# Altium schematic sheet IOa.SchDoc
size A4; SheetNumber: 8; SheetTotal: 9
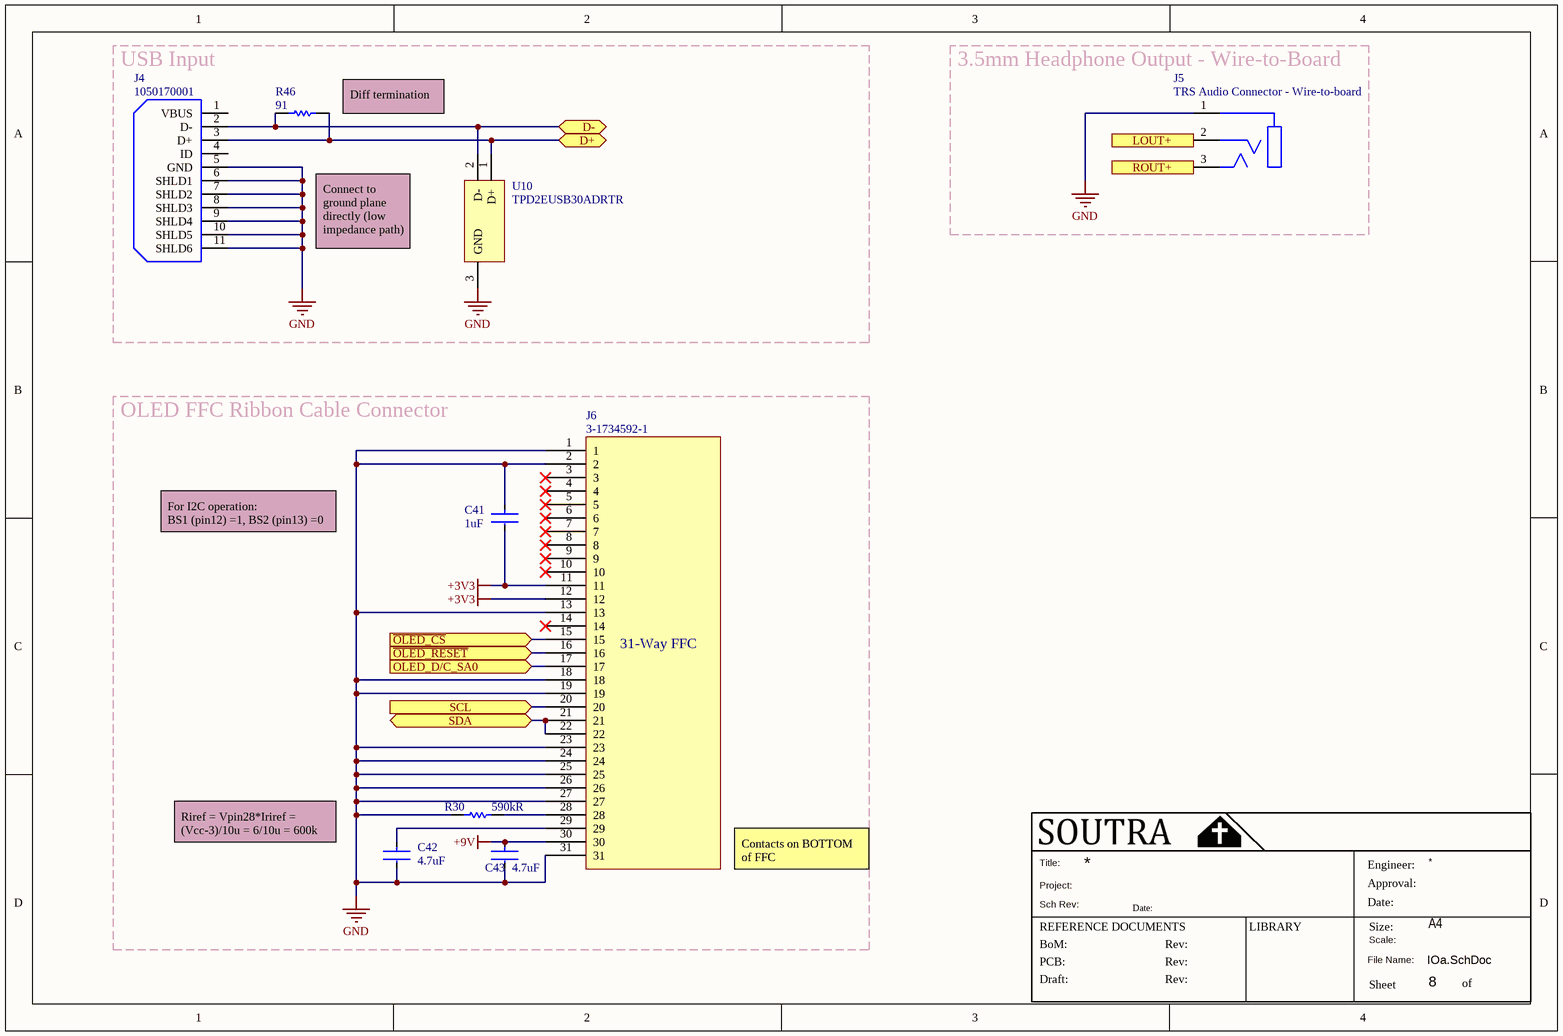
[diagram p0: IOa.SchDoc]

## Parts
C41  value 1uF  [CAPC1005X06L]  (hidden comment: CC0402KRX5R6BB105)
C42  value 4.7uF  [CC1206-IPC_A]  (hidden comment: CL31B475KAHNNNE)
C43  value 4.7uF  [CC1206-IPC_A]  (hidden comment: CL31B475KAHNNNE)
J4  1050170001  [1050170001_USB-MICRO-B_V]
J5  TRS Audio Connector - Wire-to-board  [J_GENERIC_PIN-HEADER_2.54_1X3]
J6  3-1734592-1  [AMP-TE_3-1734592-1]
R30  value 590kR  [RESC_0402_1005X40X25LL05T10]  (hidden comment: RC0402FR-07590KL)
R46  value 91  [RESC_0603_1608X06L]  (hidden comment: ERJ-PA3F91R0V)
U10  TPD2EUSB30ADRTR  [DRT0003A]

## Blocks framed on the sheet
USB Input: J4 R46 U10
3.5mm Headphone Output - Wire-to-Board: J5

## Ports
D+ (bidir, see Block Diagram[3C], MCU[1C]), D- (bidir, see Block Diagram[3C], MCU[1C]), LOUT+ (in, see Block Diagram[4C], Amplifiers[1B], CODEC[3B]), OLED_D/C_SA0 (in, see Block Diagram[3C], MCU[3C]), ROUT+ (in, see Block Diagram[4C], Amplifiers[3B], CODEC[3B]), SCL (in, see Block Diagram[3C], Amplifiers[1A], CODEC[2B], MCU[4B]), SDA (bidir, see Block Diagram[3C], Amplifiers[1A], CODEC[2B], MCU[4B]), ~{OLED_CS} (in, see Block Diagram[3C], MCU[3C]), ~{OLED_RESET} (in, see Block Diagram[3C], MCU[3C])

## Nets
+3V3: C41.2 J6.11 J6.12
+9V: C43.1 J6.30
GND: C41.1 C42.2 C43.2 J4.5(GND) J4.6(SHLD1) J4.7(SHLD2) J4.8(SHLD3) J4.9(SHLD4) J4.10(SHLD5) J4.11(SHLD6) J5.1 J6.1 J6.2 J6.13 J6.18 J6.19 J6.23 J6.24 J6.25 J6.26 J6.27 J6.31 R30.1 U10.3(GND)
~{OLED_CS}: J6.15 ; port ~{OLED_CS}
~{OLED_RESET}: J6.16 ; port ~{OLED_RESET}
D+: J4.3(D+) R46.2 U10.1(D+) ; port D+
D-: J4.2(D-) R46.1 U10.2(D-) ; port D-
LOUT+: J5.2 ; port LOUT+
OLED_D/C_SA0: J6.17 ; port OLED_D/C_SA0
ROUT+: J5.3 ; port ROUT+
SCL: J6.20 ; port SCL
SDA: J6.21 J6.22 ; port SDA
NetC42_1: C42.1 J6.29
NetJ6_28: J6.28 R30.2

Not connected (* = marked no-connect by the designer): J4 1(VBUS) 4(ID); J6 3* 4* 5* 6* 7* 8* 9* 10* 14*

## Notes on the sheet
- (near R46) Diff termination
- Connect to ground plane directly (low impedance path)
- OLED FFC Ribbon Cable Connector
- For I2C operation:
  BS1 (pin12) =1, BS2 (pin13) =0
- Riref = Vpin28*Iriref = (Vcc-3)/10u = 6/10u = 600k
- Contacts on BOTTOM of FFC
- Title:
- Project:
- Sch Rev:
- Date:
- Engineer:
- Approval:
- REFERENCE DOCUMENTS
- BoM:
- PCB:
- Draft:
- Rev:
- LIBRARY
- File Name:
- Scale:
- Size:
- Sheet
- A4
- of
- (in symbol 3-1734592-1) 31-Way FFC

## Library data of the parts
C41 = CC0402KRX5R6BB105: Ceramic Capacitor, Multilayer, Ceramic, 10V, 10% +Tol, 10% -Tol, X5R, 15% TC, 1uF, Surface Mount, 0402; Manufacturer: Yageo; Alternative Part: 0402ZD105KAT2A; Alternative Part Manufacturer: KYOCERA AVX; Multilayer: Yes; Supplier: Farnell; Supplier Part Number: 1458896; Manufacturer Part Number: CC0402KRX5R6BB105; RoHS: Yes; Category: Ceramic Capacitors; Stock: 12220000; Pricing: 10=0.039, 100=0.023; Mounting Technology: Surface Mount; Pins: 2; Dielectric Material: Ceramic; Package Shape: Rectangular; Case/Package: 0402; Terminal Finish: Nickel; Min Operating Temperature: -55°C; Max Operating Temperature: 85°C; JESD-609 Code: e3; Capacitor Type: Ceramic; Tolerance  (fill in as +-): 10%; Package Style: SMTMeter; Packaging: Tape and Reel; Tolerance (fill in as +-): 10%; Rated DC Voltage (URdc): 10V; Temperature Characteristics Code: X5R; Termination: Wraparound; Length: 1mm; Width: 0.5mm; Height: 0.5mm; Reach SVHC Compliant: Yes; RoHS Compliant: Yes; ComponentLink1URL: https://datasheet.ciiva.com:443/pdfs/VipMasterIC/IC/YAGO/YAGO-S-A0006851646/YAGO-S-A0006851646-1.pdf?src-supplier=IHS+Markit; ComponentLink1Description: https://datasheet.ciiva.com:443/pdfs/VipMasterIC/IC/YAGO/YAGO-S-A0006851646/YAGO-S-A0006851646-1.pdf?src-supplier=IHS+Markit; ComponentLink2URL: https://datasheet.ciiva.com/176/upy-gphc-x5r-4v-to-50v-12-176704.pdf?src-supplier=Digi-Key; ComponentLink2Description: https://datasheet.ciiva.com/176/upy-gphc-x5r-4v-to-50v-12-176704.pdf?src-supplier=Digi-Key; ComponentLink3URL: https://datasheet.ciiva.com/176/mlccorderingcode-176705.pdf?src-supplier=Digi-Key; ComponentLink3Description: https://datasheet.ciiva.com/176/mlccorderingcode-176705.pdf?src-supplier=Digi-Key; ComponentLink4URL: https://datasheet.ciiva.com/176/mlccorderingcode-176706.pdf?src-supplier=Digi-Key; ComponentLink4Description: https://datasheet.ciiva.com/176/mlccorderingcode-176706.pdf?src-supplier=Digi-Key; Supplier 1: Digikey; Supplier Part Number 1: 311-1439-1-ND; Pricing 1: 1=0.08, 10=0.058, 50=0.034, 100=0.027; Alternative Part Supplier: Farnell; Alternative Part Supplier Part Number: 1740588
C42 C43 = CL31B475KAHNNNE: Ceramic Capacitor, Multilayer, Ceramic, 25V, 10% +Tol, 10% -Tol, X7R, 15% TC, 4.7uF, Surface Mount, 1206; Manufacturer: Samsung; Multilayer: Yes; Supplier: Digikey; Supplier Part Number: 1276-1055-1-ND; Manufacturer Part Number: CL31B475KAHNNNE; RoHS: Yes; Category: Ceramic Capacitors; Stock: 245034; Pricing: 1=0.18, 10=0.116, 50=0.0732, 100=0.0585, 500=0.04228, 1000=0.0374 (USD); Mounting Technology: Surface Mount; Pins: 2; Dielectric Material: Ceramic; Package Shape: Rectangular; Case/Package: 1206; Terminal Finish: Nickel; Min Operating Temperature: -55°C; Max Operating Temperature: 125°C; JESD-609 Code: e3; Capacitor Type: Ceramic; Tolerance  (fill in as +-): 10%; Package Style: SMTMeter; Packaging: Tape and Reel; Tolerance (fill in as +-): 10%; Rated DC Voltage (URdc): 25V; Temperature Characteristics Code: X7R; Termination: Wraparound; Length: 3.2mm; Width: 1.6mm; Height: 1.8mm; Reach SVHC Compliant: Yes; RoHS Compliant: Yes; ComponentLink1URL: https://datasheet.ciiva.com:443/pdfs/VipMasterIC/IC/SEMS/SEMS-S-A0008522756/SEMS-S-A0008522493-1.pdf?src-supplier=IHS+Markit; ComponentLink1Description: https://datasheet.ciiva.com:443/pdfs/VipMasterIC/IC/SEMS/SEMS-S-A0008522756/SEMS-S-A0008522493-1.pdf?src-supplier=IHS+Markit; ComponentLink2URL: https://datasheet.ciiva.com/25728/cl31b475kahnnne-25728538.pdf?src-supplier=Digikey; ComponentLink2Description: https://datasheet.ciiva.com/25728/cl31b475kahnnne-25728538.pdf?src-supplier=Digikey; ComponentLink3URL: https://datasheet.ciiva.com/29200/452772-da-01-en-vs-kondensator-1206-29200897.pdf?src-supplier=Conrad; ComponentLink3Description: https://datasheet.ciiva.com/29200/452772-da-01-en-vs-kondensator-1206-29200897.pdf?src-supplier=Conrad; ComponentLink4URL: https://datasheet.ciiva.com/29200/452785-da-01-en-vs-kondensator-1206-29200901.pdf?src-supplier=Conrad; ComponentLink4Description: https://datasheet.ciiva.com/29200/452785-da-01-en-vs-kondensator-1206-29200901.pdf?src-supplier=Conrad; ComponentLink5URL: https://datasheet.ciiva.com/26310/mlcc-catalogdownload2013-eng-26310092.pdf?src-supplier=Distrelec; ComponentLink5Description: https://datasheet.ciiva.com/26310/mlcc-catalogdownload2013-eng-26310092.pdf?src-supplier=Distrelec; ComponentLink6URL: https://datasheet.ciiva.com/16428/cl10c1r5bb8nnnc-16428942.pdf?src-supplier=Future+Electronics; ComponentLink6Description: https://datasheet.ciiva.com/16428/cl10c1r5bb8nnnc-16428942.pdf?src-supplier=Future+Electronics; Supplier 1: Farnell; Supplier Part Number 1: 3013532; Pricing 1: 5=0.08, 50=0.05
J4 = 1050170001: Telecom and Datacom Connector, 5 Contact(s), Female, Right Angle, Surface Mount Terminal, Detent, Receptacle; Manufacturer Part Number: 105017-0001; Manufacturer: Molex; Supplier 1: Rs; Supplier Part Number 1: 8486764; Supplier: Farnell; Supplier Part Number: 3500663; Pricing: 1=0.97; Pricing 1: 5=0.754, 75=0.67
J5 = J_AUDIO_TRS
J6 = 3-1734592-1: FFC/FPC Connector, 31 Contact(s), 1 Row(s), Female, Right Angle, 0.02 inch Pitch, Surface Mount Terminal, Locking, Natural Insulator; Manufacturer: TE Connectivity; Connector Type: CARD EDGE CONNECTOR; Option: General Purpose; Number of Rows Loaded: 1; Number of Contacts: 31; Contact Pattern: RECTANGULAR; Contact Resistance: 35mR; Contact Style: BELLOWED TYPE; Insulation Resistance: 50MR; Rated Current (Signal): 500mA; Filter Feature: No; Dielectric Withstanding Voltage (AC): 250V; Durability: 15Cycles; Body Breadth: 0.079inch; Body Depth: 0.201inch; Body Length: 0.824inch; Reference Standard: UL; Reliability: COMMERCIAL; Supplier 1: Farnell; Supplier Part Number 1: 3398664; Manufacturer Part Number: 3-1734592-1; RoHS: Yes; Category: FFC / FPC; Stock 1: 10236; Pricing 1: 1=1.44, 10=1.26, 100=1.15; Mounting Technology: Board; Contact Finish - Mating: NOT SPECIFIED; Insulation Color: Natural; Insulation Material: Thermoplastic; Min Operating Temperature: -40°C; Max Operating Temperature: 85°C; Contact Gender: Female; Mounting Style: RIGHT ANGLE; Termination: SMD/SMT; Number Of PCB Rows: 1; PCB Contact Pattern: RECTANGULAR; Mixed Contacts: No; Manufacturer Series: 1734592; Mating Information: NO; Terminal Pitch: 0.5mm; Mating Contact Pitch: 0.02inch; Mounting Option 1: LOCKING; Flammability Rating: UL94 V-0; DIN Conformance: No; IEC Conformance: No; MIL Conformance: No; Reach SVHC Compliant: Yes; RoHS Compliant: Yes; ComponentLink1URL: https://www.te.com:443/usa-en/product-3-1734592-1.datasheet.pdf?src-supplier=IHS+Markit; ComponentLink1Description: https://www.te.com:443/usa-en/product-3-1734592-1.datasheet.pdf?src-supplier=IHS+Markit; ComponentLink2URL: https://datasheet.ciiva.com/10364/eng-ds-1-1773440-6-0506-10364463.pdf?src-supplier=Avnet; ComponentLink2Description: https://datasheet.ciiva.com/10364/eng-ds-1-1773440-6-0506-10364463.pdf?src-supplier=Avnet; ComponentLink3URL: https://datasheet.ciiva.com/8066/1650059-8066840.pdf?src-supplier=Element14; ComponentLink3Description: https://datasheet.ciiva.com/8066/1650059-8066840.pdf?src-supplier=Element14; ComponentLink4URL: https://datasheet.ciiva.com/49629/eng-ds-1-1773440-6-0506-49629301.pdf?src-supplier=Onlinecomponents.com; ComponentLink4Description: https://datasheet.ciiva.com/49629/eng-ds-1-1773440-6-0506-49629301.pdf?src-supplier=Onlinecomponents.com; ComponentLink5URL: https://datasheet.ciiva.com/671/eng-cd-1734592-c-c-1734592-671970.pdf?src-supplier=Digikey; ComponentLink5Description: https://datasheet.ciiva.com/671/eng-cd-1734592-c-c-1734592-671970.pdf?src-supplier=Digikey; ComponentLink6URL: https://datasheet.ciiva.com/671/eng-cd-1734592-c-c-1734592-671971.pdf?src-supplier=Digikey; ComponentLink6Description: https://datasheet.ciiva.com/671/eng-cd-1734592-c-c-1734592-671971.pdf?src-supplier=Digikey; ComponentLink7URL: https://datasheet.ciiva.com/671/eng-cd-1734592-c-c-1734592-671972.pdf?src-supplier=Digikey; ComponentLink7Description: https://datasheet.ciiva.com/671/eng-cd-1734592-c-c-1734592-671972.pdf?src-supplier=Digikey
R30 = RC0402FR-07590KL: Fixed Resistor, Metal Glaze/thick Film, 0.0625W, 590000ohm, 50V, 1% +/-Tol, 100ppm/Cel, Surface Mount, 0402; Manufacturer: Yageo; Alternative Part: CRCW0402590KFKED; Alternative Part Manufacturer: Vishay; Additional Feature: LASER TRIMMABLE; Power: 62.5mW; Rated Temperature: 70°C; Temperature Coefficient: 100ppm/°C; Package Height: 0.35mm; Package Length: 1mm; Package Width: 0.5mm; Supplier 1: Farnell; Supplier Part Number 1: 3951243; Manufacturer Part Number: RC0402FR-07590KL; RoHS: Yes; Category: Chip SMD Resistors; Stock 1: 37168; Pricing 1: 10=0.0096, 100=0.0055; Mounting Technology: Surface Mount; Pins: 2; Package Shape: Rectangular; Case/Package: 0402; Terminal Finish: Nickel; Min Operating Temperature: -55°C; Max Operating Temperature: 155°C; Tolerance: 1%; JESD-609 Code: e3; Resistor Type: FIXED RESISTOR; Construction: Chip; Package Style: SMTMeter; Packaging: Tape and Reel; Technology: METAL GLAZE/THICK FILM; Termination: Wraparound; Working Voltage: 50V; Reach SVHC Compliant: Yes; RoHS Compliant: Yes; ComponentLink1URL: https://datasheet.ciiva.com:443/pdfs/VipMasterIC/IC/YAGO/YAGO-S-A0008145938/YAGO-S-A0008145938-1.pdf?src-supplier=IHS+Markit; ComponentLink1Description: https://datasheet.ciiva.com:443/pdfs/VipMasterIC/IC/YAGO/YAGO-S-A0008145938/YAGO-S-A0008145938-1.pdf?src-supplier=IHS+Markit; ComponentLink2URL: https://datasheet.ciiva.com/8885/pyu-rc0402-51-rohs-l-6-8885212.pdf?src-supplier=Avnet; ComponentLink2Description: https://datasheet.ciiva.com/8885/pyu-rc0402-51-rohs-l-6-8885212.pdf?src-supplier=Avnet; ComponentLink3URL: https://datasheet.ciiva.com/17419/pyu-rc0402-51-rohs-l-6-r-17419533.pdf?src-supplier=Future+Electronics; ComponentLink3Description: https://datasheet.ciiva.com/17419/pyu-rc0402-51-rohs-l-6-r-17419533.pdf?src-supplier=Future+Electronics; Supplier 2: Digikey; Supplier Part Number 2: 311-59KLRCT-ND; Stock 2: 999878; Pricing 2: 1=0.08, 10=0.012, 50=0.007, 100=0.0058; Alternative Part Supplier: Farnell; Alternative Part Supplier Part Number: 2141013
R46 = ERJ-PA3F91R0V: Res Thick Film 0603 91 Ohm 1% 0.25W(1/4W) ±100ppm/C Pad SMD Automotive T/R; Manufacturer: Panasonic; Supplier: Farnell; Supplier Part Number: 2335962; Manufacturer Part Number: ERJ-PA3F91R0V; RoHS: Yes; Category: Chip SMD Resistors; Stock: 5736; Pricing: 10=0.05, 100=0.03; ComponentLink1URL: https://datasheet.ciiva.com/49048/1801181-49048216.pdf?src-supplier=Element14; ComponentLink1Description: https://datasheet.ciiva.com/49048/1801181-49048216.pdf?src-supplier=Element14
U10 = TPD2EUSB30ADRTR: ESD / Surge Solution for High Speed, Low Voltage Interface, 2 Channels, -40 to +85 degC, 3-pin SOT (DRT), Green (RoHS & no Sb/Br); Manufacturer: Texas Instruments; IEC 61000-4-2 Air-Gap(+/- kV): 8; SubFamily: ESD Solution; 1394 / Firewire: TRUE; IO Leakage Current(nA): 10; Differential Capacitance(pF): 0.05; Breakdown Voltage(Min)(V): 4.5; IO Capacitance(Typ)(pF): 0.7; Mounting Technology: Surface Mount; PartNumber: TPD2EUSB30ADRTR; ComponentLink2URL: SamplesURL:http://www.ti.com/product/tpd2eusb30a#samples; IEC 61000-4-2 Contact(+/- kV): 8; PackageReference: DRT0003A; Eco-Plan: Green (RoHS & no Sb/Br); ComponentLink2Description: URL Link1; USB Full Speed: TRUE; USB High Speed: TRUE; PackageDescription: 3-Flat Lead Plastic Small Outline, 1 x 1 mm (inc leads), 0.35 mm Pitch; Serial ATA / eSATA: TRUE; ComponentLink1URL: http://www.ti.com/general/docs/lit/getliterature.tsp?genericPartNumber=TPD2EUSB30A&fileType=pdf; DatasheetVersion: SLVSAC2C; PackageVersion: revD, Jun-2008; ComponentLink1Description: Datasheet; HDMI: TRUE; USB Super Speed: TRUE; Supplier 1: Farnell; Supplier Part Number 1: 3116501; Pricing 1: 5=0.53, 10=0.4, 100=0.22; Stock 1: 5225; Manufacturer Part Number: TPD2EUSB30ADRTR